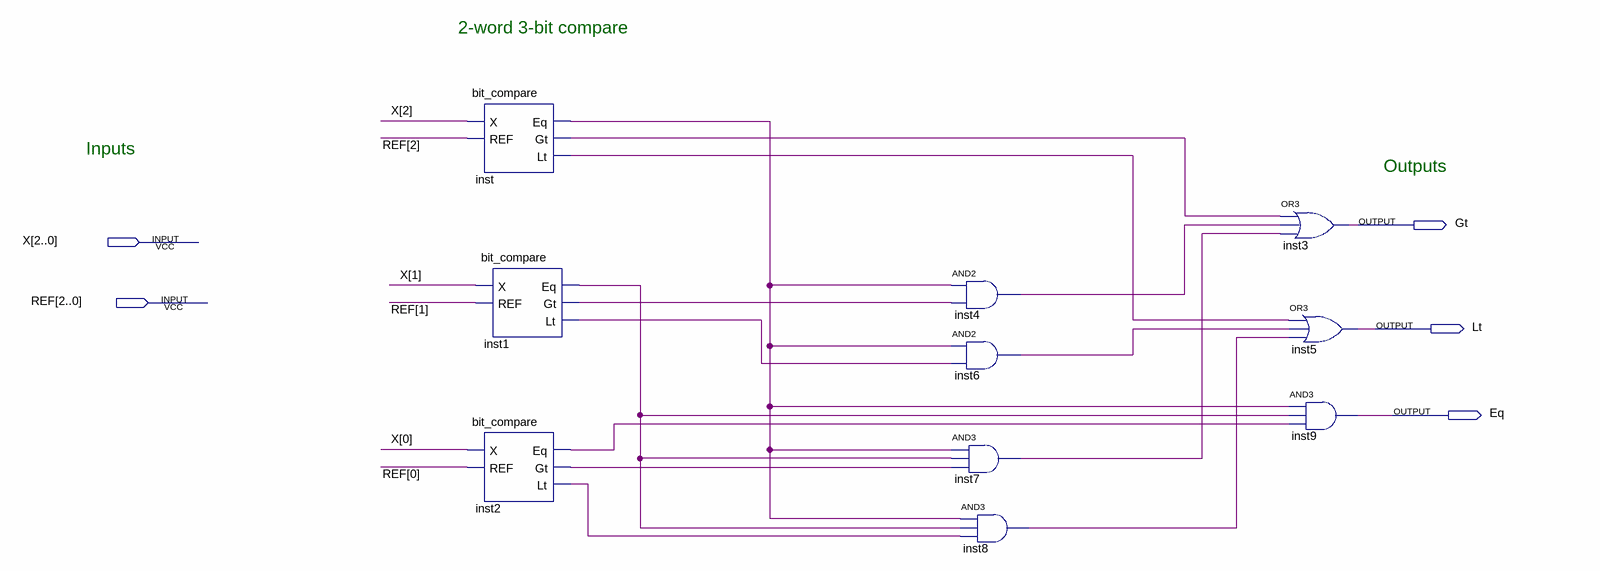
[diagram p0: schematic sheet]
// Quartus schematic 3bit_compare.bdf as structural Verilog: 10 symbols, 5 pins
module \3bit_compare  (
  input  [2:0] X,
  input  [2:0] REF,
  output Gt,
  output Lt,
  output Eq
);

  wire inst1_eq, inst1_gt, inst1_lt, inst2_eq, inst2_gt, inst2_lt, inst4_out, inst6_out, inst7_out,
       inst8_out, inst_eq, inst_gt, inst_lt;

  bit_compare inst (.X(X[2]), .REF(REF[2]), .Eq(inst_eq), .Gt(inst_gt), .Lt(inst_lt));
  bit_compare inst1 (.X(X[1]), .REF(REF[1]), .Eq(inst1_eq), .Gt(inst1_gt), .Lt(inst1_lt));
  bit_compare inst2 (.X(X[0]), .REF(REF[0]), .Eq(inst2_eq), .Gt(inst2_gt), .Lt(inst2_lt));
  and inst4 (inst4_out, inst_eq, inst1_gt);
  and inst6 (inst6_out, inst_eq, inst1_lt);
  and inst7 (inst7_out, inst_eq, inst1_eq, inst2_gt);
  and inst8 (inst8_out, inst_eq, inst1_eq, inst2_lt);
  or inst3 (Gt, inst_gt, inst4_out, inst7_out);
  or inst5 (Lt, inst_lt, inst6_out, inst8_out);
  and inst9 (Eq, inst_eq, inst1_eq, inst2_eq);

  // Notes on the sheet:
  //   2-word 3-bit compare   
  //   Inputs
  //   Outputs
endmodule
